# EAGLE design ird (EAGLE 5.09)
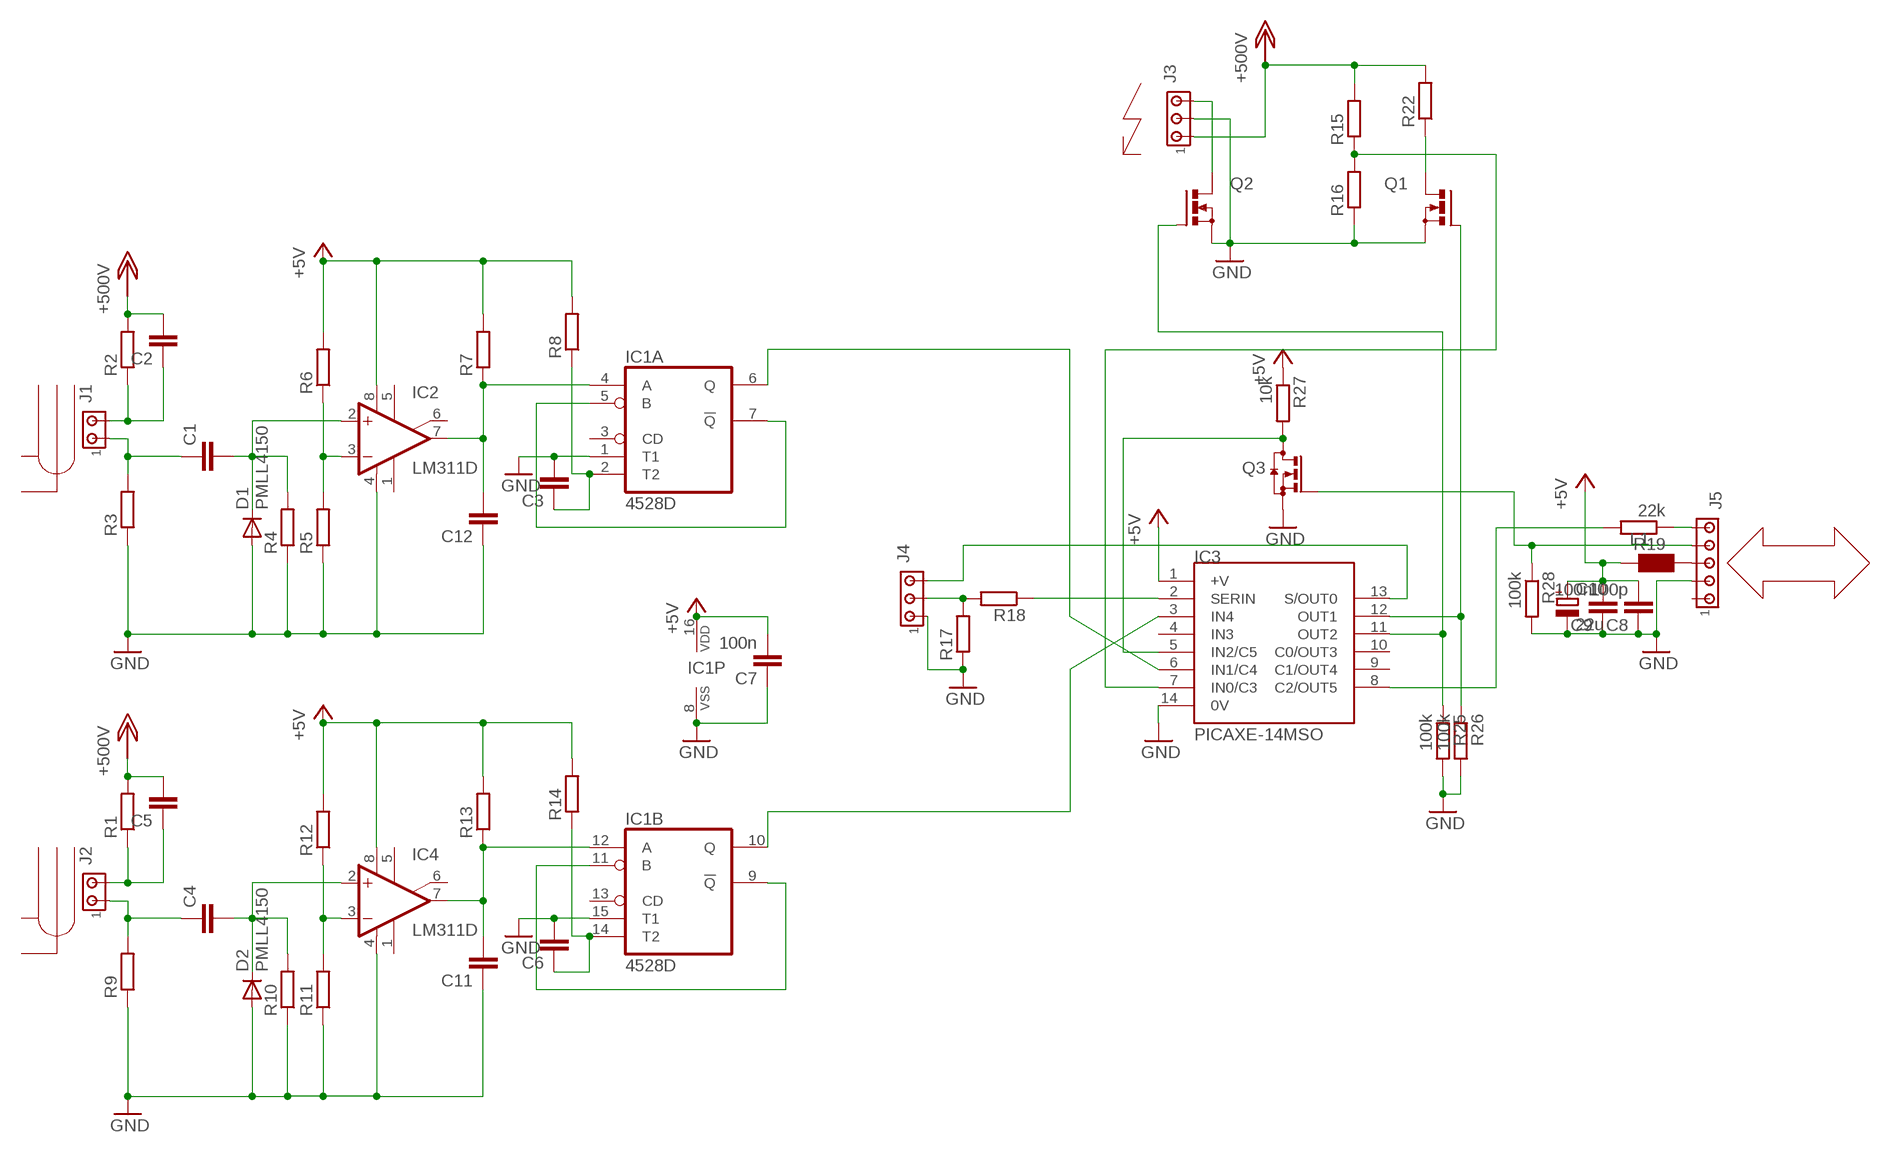
[diagram p0: schematic, sheet 1]

## Parts
C1  C-EUC0805  [C0805]
C2  C-EU075-042X103  [C075-042X103]
C3  C-EUC0805  [C0805]
C4  C-EUC0805  [C0805]
C5  C-EU075-042X103  [C075-042X103]
C6  C-EUC0805  [C0805]
C7  100n  C-EUC0805  [C0805]
C8  100p  C-EUC0805  [C0805]
C9  100n  C-EUC0805  [C0805]
C10  22u  CPOL-EUB/3528-21R  [B/3528-21R]
C11  C-EUC0805  [C0805]
C12  C-EUC0805  [C0805]
D1  PMLL4150  [SOD80C]
D2  PMLL4150  [SOD80C]
IC1  4528D  [SO16]
IC2  LM311D  [SO08]
IC3  PICAXE-14MSO  [SO-14]
IC4  LM311D  [SO08]
J1  MTA02-100  [10X02MTA]
J2  MTA02-100  [10X02MTA]
J3  MTA03-100  [10X03MTA]
J4  MTA03-100  [10X03MTA]
J5  MTA05-100  [10X05MTA]
L1  WE-CBF_1812  [1812]
Q1  IRF512  [TO220BV]
Q2  IRF512  [TO220BV]
Q3  BSS123  [SOT23]
R1  R-EU_0207/10  [0207/10]
R2  R-EU_0207/10  [0207/10]
R3  R-EU_R0805  [R0805]
R4  R-EU_R0805  [R0805]
R5  R-EU_R0805  [R0805]
R6  R-EU_R0805  [R0805]
R7  R-EU_R0805  [R0805]
R8  R-EU_R0805  [R0805]
R9  R-EU_R0805  [R0805]
R10  R-EU_R0805  [R0805]
R11  R-EU_R0805  [R0805]
R12  R-EU_R0805  [R0805]
R13  R-EU_R0805  [R0805]
R14  R-EU_R0805  [R0805]
R15  R-EU_0207/10  [0207/10]
R16  R-EU_0207/10  [0207/10]
R17  R-EU_R0805  [R0805]
R18  R-EU_R0805  [R0805]
R19  22k  R-EU_R0805  [R0805]
R22  R-EU_0207/10  [0207/10]
R25  100k  R-EU_R0805  [R0805]
R26  100k  R-EU_R0805  [R0805]
R27  10k  R-EU_R0805  [R0805]
R28  100k  R-EU_R0805  [R0805]

## Nets
+5V: C7.2 C8.2 C9.2 C10.+ IC1.16(P:VDD) IC2.8(V+) IC3.1(+V) IC4.8(V+) L1.1 R6.2 R7.2 R8.2 R12.2 R13.2 R14.2 R27.1
+500V: C2.2 C5.2 J3.1 R1.2 R2.2 R15.2 R22.2
GND: C3.2 C6.2 C7.1 C8.1 C9.1 C10.- C11.1 C12.1 D1.A D2.A IC1.1(A:T1) IC1.8(P:VSS) IC1.15(B:T1) IC2.4(V-) IC3.14(0V) IC4.4(V-) J3.2 J4.1 J5.2 Q1.S Q2.S Q3.2(S) R3.1 R4.1 R5.1 R9.1 R10.1 R11.1 R16.1 R17.1 R25.2 R26.2 R28.2
N$1: IC1.9(B:!Q) IC1.11(B:B)
N$2: IC1.5(A:B) IC1.7(A:!Q)
N$3: J3.3 Q2.D
N$4: C2.1 J1.2 R2.1
N$5: C1.1 J1.1 R3.2
N$6: C1.2 D1.C IC2.2(+IN) R4.2
N$7: IC3.5(IN2/C5) Q3.3(D) R27.2
N$8: IC2.3(-IN) R5.2 R6.1
N$9: IC3.7(IN0/C3) R15.1 R16.2
N$10: C5.1 J2.2 R1.1
N$11: C4.1 J2.1 R9.2
N$12: C4.2 D2.C IC4.2(+IN) R10.2
N$13: C12.2 IC1.4(A:A) IC2.7(OUT) R7.1
N$14: C3.1 IC1.2(A:T2) R8.1
N$15: IC4.3(-IN) R11.2 R12.1
N$16: C11.2 IC1.12(B:A) IC4.7(OUT) R13.1
N$17: C6.1 IC1.14(B:T2) R14.1
N$19: J4.2 R17.2 R18.2
N$21: IC3.13(S/OUT0) J4.3
N$22: IC3.2(SERIN) R18.1
N$23: J5.3 L1.2
N$24: IC3.8(C2/OUT5) R19.2
N$25: J5.4 Q3.1(G) R28.1
N$27: IC1.10(B:Q) IC3.3(IN4)
N$28: J5.5 R19.1
N$30: IC1.6(A:Q) IC3.6(IN1/C4)
N$31: Q1.D R22.1
N$32: IC3.12(OUT1) Q1.G R26.1
N$33: IC3.11(OUT2) Q2.G R25.1
Unconnected: IC1.3(A:CD) IC1.13(B:CD) IC2.1(GND) IC2.5(ON) IC2.6(ON/STR) IC3.4(IN3) IC3.9(C1/OUT4) IC3.10(C0/OUT3) IC4.1(GND) IC4.5(ON) IC4.6(ON/STR) J5.1

## Library data of the parts
C1-C9 C11 C12 = rcl:C-EU: CAPACITOR, European symbol
C10 = rcl:CPOL-EU: POLARIZED CAPACITOR, European symbol
D1 D2 = diode:PMLL4150: DIODE high speed
IC1 = 45xx:4528: Dual monostable MULTIVIBRATOR
IC2 IC4 = linear:LM311: COMPARATOR
IC3 = Mine:PICAXE-14M
J1 J2 = con-amp:MTA02-100: AMP connector
J3 J4 = con-amp:MTA03-100: AMP connector
J5 = con-amp:MTA05-100: AMP connector
L1 = wuerth-elektronik:WE-CBF: SMD EMI Suppression Ferrite Beads - excellent anti-EMI properties - low DCR - impedances till 3000 ohms - rated current up to 6 A
Q1 Q2 = transistor-power:IRF512: N-CHANNEL MOS FET
Q3 = transistor-small-signal:BSS123: N-CHANNEL MOS FET
R1-R19 R22 R25-R28 = rcl:R-EU_: RESISTOR, European symbol

## Board
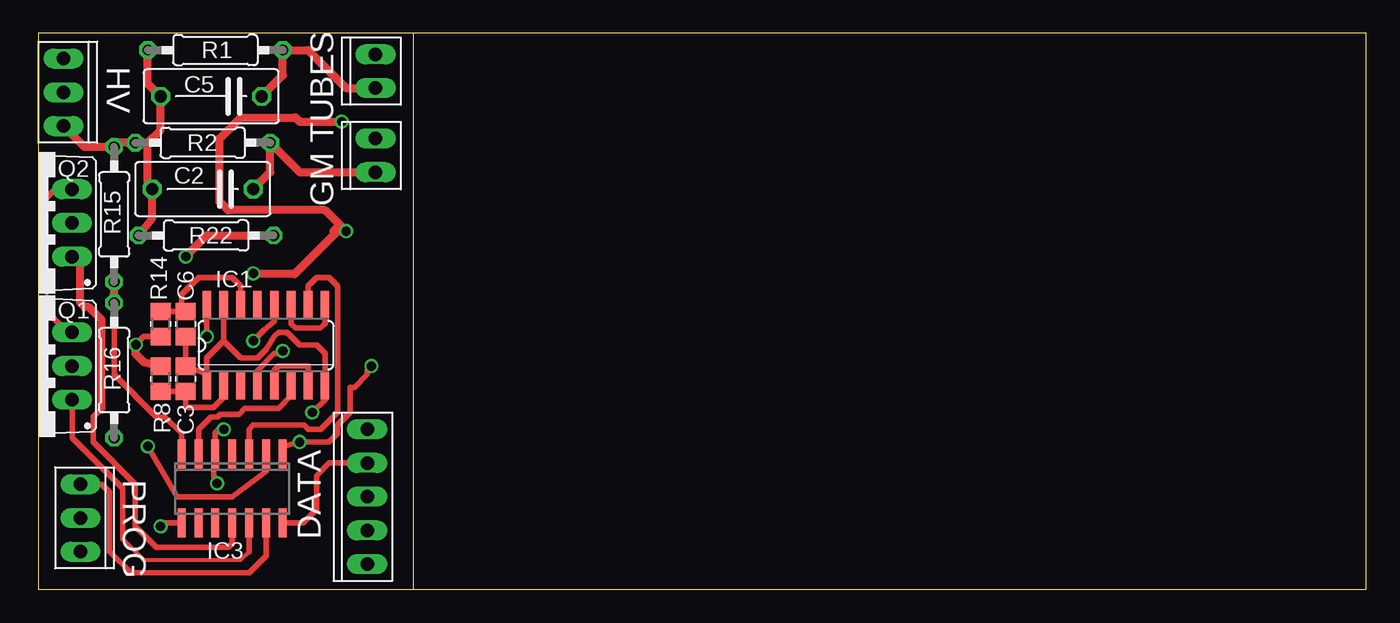
[diagram p1: board, top side]
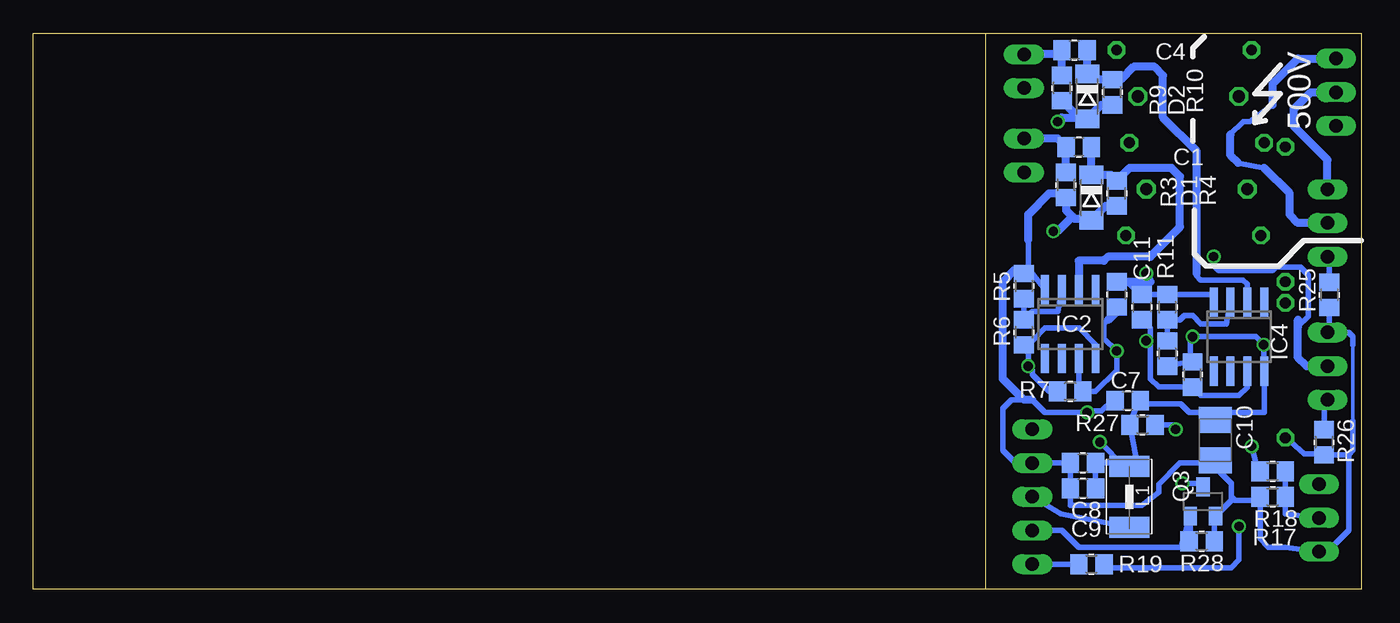
[diagram p2: board, bottom side, seen from below]

Size 100 x 41.91 mm. Coordinates in mm from the lower left corner, seen from the top.
Outline: 28.26,0 28.26,41.91
Outline: 28.26,0 100,0 100,41.9 0,41.9 0,0 28.26,0
Copper layers (1*16): Top 0.035mm / dielectric 1.5mm / Bottom 0.035mm
Design rules "Fusion_eagle_rule_v1.1": minimum track width 6mil, minimum drill 12mil, track to track 6mil, track to pad 6mil, pad to pad 6mil, via to via 6mil, smd to smd 0mil, copper to edge 10mil, drill to drill 10mil, minimum pad ring 10mil, minimum via ring 6mil, stop-mask expansion 2mil, vias tented up to drill 100mil, thermal gap 10mil

### Footprints (pad centres in the part's own frame; a part is rotated, then mirrored left to right if it is on the bottom)
C0805 = smd 1.3 x 1.5: 1 -0.95,0; 2 0.95,0
C075-042X103 = drill 0.914 octagon: 1 -3.81,0; 2 3.81,0
B/3528-21R = smd 1.95 x 2.5: + 1.525,0; - -1.525,0
SOD80C = smd 1.4 x 1.8: A 1.7,0; C -1.7,0
SO16 = smd 0.66 x 2.032: 1 -4.445,-3.073; 2 -3.175,-3.073; 3 -1.905,-3.073; 4 -0.635,-3.073; 5 0.635,-3.073; 6 1.905,-3.073; 7 3.175,-3.073; 8 4.445,-3.073; 9 4.445,3.073; 10 3.175,3.073; 11 1.905,3.073; 12 0.635,3.073; 13 -0.635,3.073; 14 -1.905,3.073; 15 -3.175,3.073; 16 -4.445,3.073
SO08 = smd 0.6 x 2.2: 1 -1.905,-2.6; 2 -0.635,-2.6; 3 0.635,-2.6; 4 1.905,-2.6; 5 1.905,2.6; 6 0.635,2.6; 7 -0.635,2.6; 8 -1.905,2.6
SO-14 = smd 0.6 x 2.2: 1 -3.81,-2.6; 2 -2.54,-2.6; 3 -1.27,-2.6; 4 0,-2.6; 5 1.27,-2.6; 6 2.54,-2.6; 7 3.81,-2.6; 8 3.81,2.6; 9 2.54,2.6; 10 1.27,2.6; 11 0,2.6; 12 -1.27,2.6; 13 -2.54,2.6; 14 -3.81,2.6
10X02MTA = drill 1.016 long: 1 1.27,0; 2 -1.27,0
10X03MTA = drill 1.016 long: 1 2.54,0; 2 0,0; 3 -2.54,0
10X05MTA = drill 1.016 long: 1 5.08,0; 2 2.54,0; 3 0,0; 4 -2.54,0; 5 -5.08,0
1812 = smd 1.6 x 3: 1 -2.3,0; 2 2.3,0
TO220BV = drill 1.016 long: D 0,-2.54; G -2.54,-2.54; S 2.54,-2.54
SOT23 = smd 1 x 1.4: 1 -0.95,-1.1; 2 0.95,-1.1; 3 0,1.1
0207/10 = drill 0.813 octagon: 1 -5.08,0; 2 5.08,0
R0805 = smd 1.3 x 1.5: 1 -0.95,0; 2 0.95,0

### Placement (x,y rotation side)
C1  21.27,33.34 0 bottom
C2  12.38,30.16 180 top
C3  11.11,15.88 90 top
C4  21.59,40.64 0 bottom
C5  13.02,37.15 180 top
C6  11.11,20 270 top
C7  17.59,14.22 0 bottom
C8  20.95,9.53 0 bottom
C9  20.95,7.62 0 bottom
C10  10.99,11.24 90 bottom
C11  16.51,21.27 270 bottom
C12  18.41,22.23 270 bottom
D1  20.32,29.53 270 bottom
D2  20.64,37.15 270 bottom
IC1  17.14,18.41 0 top
IC2  21.91,20 180 bottom
IC3  14.61,7.62 180 top
IC4  9.21,19.05 180 bottom
J1  25.4,32.7 90 top
J2  25.4,39.05 90 top
J3  1.91,37.47 270 top
J4  3.17,5.4 270 top
J5  24.77,6.99 90 top
L1  17.46,6.99 270 bottom
Q1  0,16.83 90 top
Q2  0,27.62 90 top
Q3  11.92,6.63 0 bottom
R1  13.34,40.64 180 top
R2  12.38,33.66 180 top
R3  22.23,30.48 90 bottom
R4  18.41,29.84 90 bottom
R5  25.4,22.86 270 bottom
R6  25.4,19.37 270 bottom
R7  21.91,14.92 180 bottom
R8  9.21,15.88 90 top
R9  22.54,37.78 90 bottom
R10  18.73,37.47 90 bottom
R11  14.61,21.27 270 bottom
R12  14.61,17.78 270 bottom
R13  12.7,16.19 90 bottom
R14  9.21,20 270 top
R15  5.71,28.26 90 top
R16  5.71,16.51 90 top
R17  6.67,6.99 0 bottom
R18  6.67,8.89 0 bottom
R19  20.32,1.91 0 bottom
R22  12.64,26.67 180 top
R25  2.4,22.2 270 bottom
R26  2.8,11.1 270 bottom
R27  16.47,12.41 0 bottom
R28  12.02,3.63 0 bottom

### Tracks (layer width: path | path; a pad name or v marks a point on that pad's centre or on a via)
+5V  (via drill 0.7)
  Top 0.406: v12.7,19.05 IC1.16 | IC3.1 18.48,10.79 v19.68,11.11 21.91,11.11 22.54,11.75 22.54,12.38 23.5,13.34 23.5,15.24 23.81,15.24 24.77,16.19 24.77,16.51 v25.08,16.83 | 7.3,18.4 7.3,18.41 7.94,19.05 R14.2
  Top 0.61: R8.2 7.94,17.14 7.3,17.78 7.3,18.4 v7.35,18.44
  Bottom 0.406: R12.2 13.02,17.15 12.86,17.3 | 11.11,13.34 7.3,13.34 IC4.8 7.3,17.14 7.35,17.14 v7.35,18.44 7.96,19.05 v12.7,19.05 12.86,18.89 12.86,17.3 | 17.86,9.29 L1.1 17.26,9.29 16.91,9.63 R27.1 16.91,13.95 C7.2 16.39,13.97 13.59,13.97 12.95,13.34 11.11,13.34 | 17.86,9.29 v19.68,11.11 | C9.2 C8.2 18.78,9.53 18.45,9.19 18.4,9.19 18.3,9.29 17.86,9.29 | R7.2 23.5,14.92 24.77,16.19 24.77,16.51 v25.08,16.83 25.08,18.1 R6.2 25.09,18.73 24.77,18.73 23.81,19.68 21.21,19.68 20,18.48 IC2.8 | R13.2 12.86,17.3 | 11.11,13.34 11.11,12.89 C10.+
+500V
  Top 0.61: R1.2 8.26,38.1 C5.2 9.21,34.61 8.26,33.66 | J3.1 3.49,33.34 R15.2 6.03,33.66 R2.2 8.26,33.66 | 8.26,33.66 8.26,30.48 C2.2 8.57,27.94 R22.2
GND  (via drill 0.7)
  Top 0.254: 0.64,20.95 0.64,29.53
  Top 0.406: Q1.S 2.22,19.37 0.64,20.95 | 0.64,29.53 1.27,30.16 Q2.S | IC3.14 19.94,5.02 20.95,6.03 20.95,8.57 C8.1 J5.2 | v20.64,13.34 21.59,14.29 IC1.8 21.59,17.78 20.95,18.41 19.68,18.41 18.73,19.37 18.1,19.37 17.78,19.05 17.14,18.1 16.51,17.46 15.24,17.46 13.97,18.73 | 12.51,16.3 C3.2 C6.2 | 12.51,16.3 12.8,16.2 IC1.1 | 13.97,18.73 12.7,17.46 12.7,16.5 12.51,16.3 | 13.97,18.73 IC1.15
  Top 0.61: v22.86,35.24 19.68,35.24 19.37,35.56 15.24,35.56 13.65,33.97 13.65,29.21 14.29,28.57 21.59,28.57 v23.18,26.99 22.86,27.3 22.54,27.3 22.23,26.99 22.54,26.99 19.3,23.75 16.26,23.75 v16.19,23.81
  Bottom 0.254: 0.64,12.7 0.64,18.41
  Bottom 0.406: IC2.4 24.77,23.81 25.08,23.81 25.08,24.13 | IC4.4 11.05,22.22 R11.1 C11.1 16.83,22.54 | 0.95,10.16 0.95,4.45 1.91,3.49 J4.1 5.71,3.17 6.99,3.17 7.62,3.81 R17.1 8,6.73 9.52,6.73 9.78,6.99 | R5.1 25.72,23.81 25.78,23.81 25.78,23.35 25.72,23.35 25.72,24.13 25.08,24.13 | 25.08,24.13 25.08,26.35 | 0.64,18.41 0.64,19.05 0.95,19.37 Q1.S 2.4,19.51 R25.2 | 0.64,12.7 | 0.64,12.7 0.64,10.48 0.95,10.16 | 0.95,10.16 2.31,10.16 R26.2 2.25,10.2 4.3,10.2 5.63,11.43 R16.1 | C7.1 18.8,14.22 19.56,13.46 20.51,13.46 v20.64,13.34 23.81,13.34 24.77,14.29 26.35,14.29 26.99,13.65 26.99,10.48 26.04,9.53 J5.2 C8.1 C9.1 21.91,6.35 16.51,6.35 15.24,7.3 15.24,7.94 13.65,9.53 11.18,9.53 C10.- 10.99,9.21 9.78,8 9.78,7.28 | 9.78,6.99 9.78,7.28 | 9.78,6.99 9.78,6.72 Q3.2 11.07,5.43 R28.2 | 9.78,7.28 9.77,7.27
  Bottom 0.61: R10.1 19.57,36.52 D2.A 20.64,35.56 | 20.64,35.56 20.64,35.88 | 21.27,35.56 20.64,35.56 | 21.27,35.56 R9.1 | R4.1 19.25,28.89 D1.A 20.43,27.94 21.59,27.94 21.75,28.1 | C11.1 17.46,23.18 C12.1 15.88,23.18 v16.19,23.81 | 24.77,14.29 25.4,14.29 26.99,15.88 26.99,23.18 26.04,24.13 25.72,24.13 R5.1 | 25.08,26.35 25.08,28.26 23.5,29.84 22.23,29.84 R3.1 22.23,28.57 21.75,28.1 | Q2.S 2.54,32.38 5.08,34.92 5.08,36.2 3.81,37.47 J3.2 | 21.27,35.56 22.54,35.56 v22.86,35.24 | v23.18,26.99 22.86,26.99 21.75,28.1
N$1
  Top 0.406: IC1.9 21.59,20 21.21,19.68 19.37,19.68 19.05,20 IC1.11
N$2
  Top 0.406: IC1.7 20.32,16.83 18.1,16.83 17.78,16.51 IC1.5
N$3
  Bottom 0.406: 7.3,31.75 9.27,32.13 | 9.84,34.29 8.89,35.24 8.39,35.24 6.67,36.51
  Bottom 0.61: Q2.D 4.76,27.62 5.4,28.26 5.4,29.84 7.3,31.75 | J3.3 4.76,40.01 6.67,38.1 6.67,36.51 | 9.27,32.13 9.84,32.7 9.84,34.29
N$4
  Top 0.61: J1.2 19.68,31.43 R2.1 17.46,31.43 C2.1
N$5
  Bottom 0.61: J1.1 22.86,33.97 C1.1 R3.2
N$6
  Bottom 0.61: IC2.2 21.27,24.77 19.37,24.77 19.05,25.08 15.88,25.08 13.65,27.3 13.65,31.11 14.29,31.75 17.46,31.75 R4.2 18.85,31.23 D1.C C1.2
N$7  (via drill 0.7)
  Top 0.406: v13.46,8 13.46,8.26 13.21,8.51 13.21,10.09 IC3.5 13.34,11.81 13.59,12.06 v13.97,12.06
  Bottom 0.406: R27.2 13.94,12.41 v13.97,12.06 | v13.46,8 12.19,8 Q3.3
N$8
  Bottom 0.406: IC2.3 22.86,20.95 24.76,20.95 R6.1 R5.2
N$9
  Top 0.406: R16.2 5.71,16.19 8.89,13.02 9.53,13.02 10.79,11.75 IC3.7
  Top 0.61: R16.2 R15.1
N$10
  Top 0.61: J2.2 23.18,37.78 20.32,40.64 R1.1 18.41,38.73 C5.1
N$11
  Bottom 0.61: J2.1 22.86,40.32 C4.1 R9.2
N$12
  Bottom 0.406: 12.38,23.81 12.38,23.61 12.1,23.33 8.9,23.33 8.57,23 IC4.2
  Bottom 0.61: C4.2 D2.C 20.2,38.41 R10.2 18.1,38.41 17.14,39.37 15.56,39.37 14.92,38.73 14.92,35.56 12.38,33.02 12.38,23.81
N$13  (via drill 0.7)
  Top 0.406: IC1.4 16.51,16.51 17.78,17.78 18.41,17.78 18.73,18.1 v18.41,17.97
  Bottom 0.406: IC2.7 21.27,15.24 R7.1 20,14.92 18.41,16.51 v18.41,17.97 19.37,18.92 19.37,20 19.05,20.32
  Bottom 0.61: C12.2 18.41,20.95 19.05,20.32
N$14
  Top 0.406: R8.1 C3.1 11.12,13.71 13.21,13.71 13.97,14.48 IC1.2
N$15
  Bottom 0.406: IC4.3 10.16,20 12.06,20 12.7,20.64 13.34,20.64 13.65,20.32 14.29,20.32 14.29,20.64 R11.2 R12.1
N$16  (via drill 0.7)
  Top 0.406: IC1.12 17.78,20.32 17.78,20.19 17.02,19.56 v16.19,18.73
  Bottom 0.406: IC4.7 8.57,15.24 9.21,14.61 12.06,14.61 R13.1 15.24,15.24 15.88,15.88 15.88,19.05 | 15.88,19.05 15.88,19.69 C11.2 | 15.88,19.05 v16.19,18.73
N$17
  Top 0.406: R14.1 C6.1 10.79,21.27 10.79,22.23 12.06,23.5 14.61,23.5 15.24,22.86 IC1.14
N$19
  Bottom 0.406: J4.2 5.72,5.71 R18.2 R17.2
N$21
  Top 0.406: J4.3 4.76,7.94 5.4,7.3 5.4,2.86 6.99,1.27 15.88,1.27 17.14,2.54 IC3.13
N$22  (via drill 0.7)
  Top 0.406: IC3.2 17.14,8.89 14.61,6.99 10.48,6.99 v8.26,10.79
  Bottom 0.406: R18.1 7.94,9.53 v8.26,10.79
N$23
  Bottom 0.406: J5.3 22.62,5.71 L1.2
N$24  (via drill 0.7)
  Top 0.406: IC3.8 9.46,5.02 v9.21,4.76
  Bottom 0.406: v9.21,4.76 9.21,2.22 9.78,1.65 18.92,1.65 19.18,1.91 R19.2
N$25
  Bottom 0.406: J5.4 22.54,4.45 21.27,3.17 13.57,3.17 Q3.1 12.87,3.72 R28.1
N$27
  Top 0.406: IC1.10 20.32,22.86 20.95,23.5 21.91,23.5 22.54,22.86 22.54,13.34 21.27,12.06 20.32,12.06 20,12.38 16.19,12.38 15.88,12.06 IC3.3
N$28
  Bottom 0.406: R19.1 J5.5
N$30
  Top 0.406: IC1.6 19.05,14.61 18.1,13.65 15.56,13.65 15.11,13.21 13.72,13.21 13.53,13.02 13.02,13.02 12.06,12.06 IC3.6
N$31  (via drill 0.7)
  Top 0.61: R22.1 12.7,26.67 v11.11,25.08
  Bottom 0.406: Q1.D 4.13,16.83 | v11.11,25.08 11.11,24.41 10.73,24.03 6.7,24.03 6.43,24.3 4.6,24.3 4,23.7 4,20.56 4.76,19.8
  Bottom 0.61: 4.13,16.83 4.76,17.46 4.76,19.8 4.76,20.32
N$32
  Top 0.305: 15.88,2.86 15.24,2.22 7.94,2.22 6.35,3.81
  Top 0.406: 15.88,2.86 IC3.12 | 6.35,3.81 6.35,7.62 2.54,11.43 Q1.G
  Bottom 0.406: R26.1 2.8,14.03 Q1.G
N$33
  Top 0.406: IC3.11 14.61,3.49 14.29,3.17 8.89,3.17 7.3,4.76 7.3,7.94 4.13,11.11 4.13,13.02 4.76,13.65 | Q2.G 3.81,25.08
  Top 0.61: Q2.G 3.17,24.45 3.17,21.59 3.49,21.27 3.81,21.27 4.76,20.32 4.76,13.65
  Bottom 0.406: R25.1 2.4,24.94 Q2.G

### Text on the board
tPlace: HV | GM TUBES | PROG | DATA
_tsilk: APEX | 5/10 | V 2.0 | A COWAN | M BREJZA | IRD BOARD
_bsilk: 500V